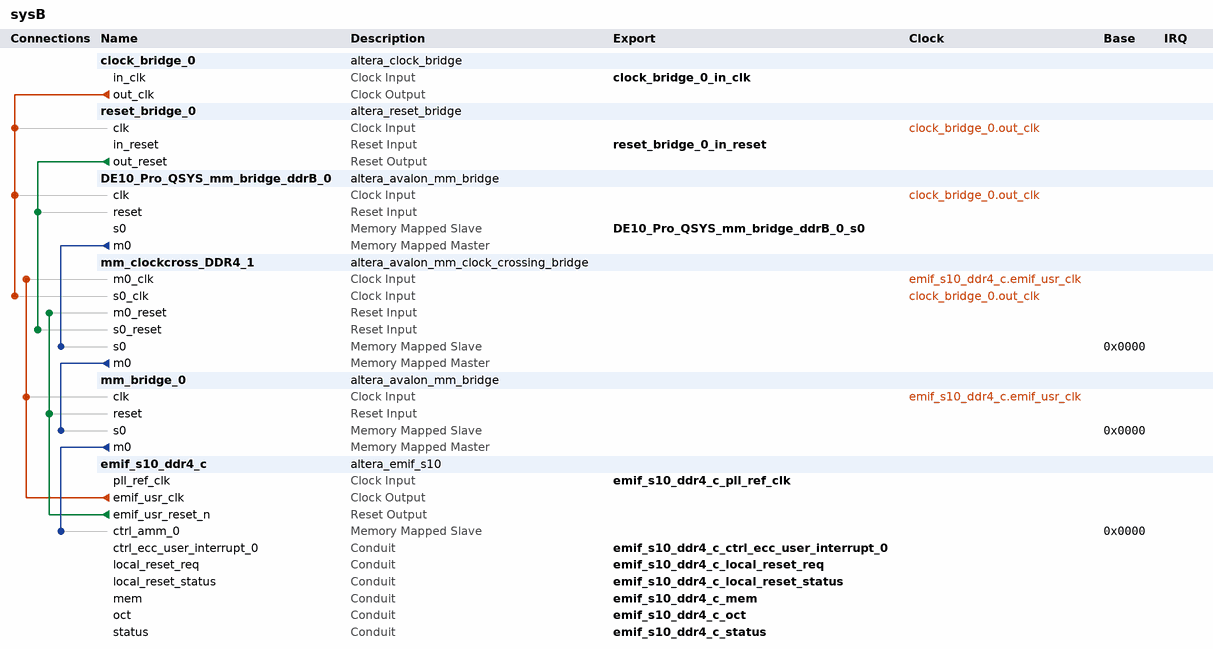
[diagram p0: system contents]
# Platform Designer (Qsys) system sysB, Stratix 10 1SX280HU2F50E1VG
# Parameters at their usual value, and those the tool derives, are not listed.
package require -exact qsys 1.0
create_system sysB
set_project_property DEVICE_FAMILY {Stratix 10}
set_project_property DEVICE 1SX280HU2F50E1VG

add_component clock_bridge_0 ip/sysB/sysB_clock_bridge_0.ip altera_clock_bridge clock_bridge_0 19.1
load_component clock_bridge_0
set_component_parameter_value DERIVED_CLOCK_RATE 100000000
set_component_parameter_value EXPLICIT_CLOCK_RATE 0
save_component

add_component reset_bridge_0 ip/sysB/sysB_reset_bridge_0.ip altera_reset_bridge reset_bridge_0 19.1
load_component reset_bridge_0
set_component_parameter_value ACTIVE_LOW_RESET 0
set_component_parameter_value SYNCHRONOUS_EDGES deassert
set_component_parameter_value SYNC_RESET 0
save_component

add_component DE10_Pro_QSYS_mm_bridge_ddrB_0 ip/DE10_Pro_QSYS/DE10_Pro_QSYS_mm_bridge_ddrB_0.ip altera_avalon_mm_bridge DE10_Pro_QSYS_mm_bridge_ddrB_0 19.1

add_component mm_clockcross_DDR4_1 ip/DE10_Pro_QSYS/mm_clockcross_DDR4_0.ip altera_avalon_mm_clock_crossing_bridge mm_clockcross_DDR4_1 19.1

add_component mm_bridge_0 ip/sysB/sysB_mm_bridge_0.ip altera_avalon_mm_bridge mm_bridge_0 19.1
load_component mm_bridge_0
set_component_parameter_value DATA_WIDTH 256
set_component_parameter_value ADDRESS_WIDTH 10
set_component_parameter_value USE_AUTO_ADDRESS_WIDTH 1
set_component_parameter_value ADDRESS_UNITS WORDS
set_component_parameter_value MAX_PENDING_RESPONSES 4
set_component_parameter_value SYNC_RESET 0
save_component

add_component emif_s10_ddr4_c ip/DE10_Pro_QSYS/DE10_Pro_QSYS_emif_s10_ddr4_c.ip altera_emif_s10 emif_s10_ddr4_c 19.1.0

# connections
add_connection clock_bridge_0.out_clk DE10_Pro_QSYS_mm_bridge_ddrB_0.clk clock
add_connection clock_bridge_0.out_clk mm_clockcross_DDR4_1.s0_clk clock
add_connection clock_bridge_0.out_clk reset_bridge_0.clk clock
add_connection emif_s10_ddr4_c.emif_usr_clk mm_bridge_0.clk clock
add_connection emif_s10_ddr4_c.emif_usr_clk mm_clockcross_DDR4_1.m0_clk clock
add_connection emif_s10_ddr4_c.emif_usr_reset_n mm_bridge_0.reset reset
add_connection emif_s10_ddr4_c.emif_usr_reset_n mm_clockcross_DDR4_1.m0_reset reset
add_connection reset_bridge_0.out_reset DE10_Pro_QSYS_mm_bridge_ddrB_0.reset reset
add_connection reset_bridge_0.out_reset mm_clockcross_DDR4_1.s0_reset reset
add_connection DE10_Pro_QSYS_mm_bridge_ddrB_0.m0 mm_clockcross_DDR4_1.s0 avalon
set_connection_parameter_value DE10_Pro_QSYS_mm_bridge_ddrB_0.m0/mm_clockcross_DDR4_1.s0 baseAddress 0x0000
add_connection mm_bridge_0.m0 emif_s10_ddr4_c.ctrl_amm_0 avalon
set_connection_parameter_value mm_bridge_0.m0/emif_s10_ddr4_c.ctrl_amm_0 baseAddress 0x0000
add_connection mm_clockcross_DDR4_1.m0 mm_bridge_0.s0 avalon
set_connection_parameter_value mm_clockcross_DDR4_1.m0/mm_bridge_0.s0 baseAddress 0x0000

# exported interfaces
add_interface DE10_Pro_QSYS_mm_bridge_ddrB_0_s0 avalon slave
set_interface_property DE10_Pro_QSYS_mm_bridge_ddrB_0_s0 EXPORT_OF DE10_Pro_QSYS_mm_bridge_ddrB_0.s0
add_interface clock_bridge_0_in_clk clock sink
set_interface_property clock_bridge_0_in_clk EXPORT_OF clock_bridge_0.in_clk
add_interface emif_s10_ddr4_c_ctrl_ecc_user_interrupt_0 conduit end
set_interface_property emif_s10_ddr4_c_ctrl_ecc_user_interrupt_0 EXPORT_OF emif_s10_ddr4_c.ctrl_ecc_user_interrupt_0
add_interface emif_s10_ddr4_c_local_reset_req conduit end
set_interface_property emif_s10_ddr4_c_local_reset_req EXPORT_OF emif_s10_ddr4_c.local_reset_req
add_interface emif_s10_ddr4_c_local_reset_status conduit end
set_interface_property emif_s10_ddr4_c_local_reset_status EXPORT_OF emif_s10_ddr4_c.local_reset_status
add_interface emif_s10_ddr4_c_mem conduit end
set_interface_property emif_s10_ddr4_c_mem EXPORT_OF emif_s10_ddr4_c.mem
add_interface emif_s10_ddr4_c_oct conduit end
set_interface_property emif_s10_ddr4_c_oct EXPORT_OF emif_s10_ddr4_c.oct
add_interface emif_s10_ddr4_c_pll_ref_clk clock sink
set_interface_property emif_s10_ddr4_c_pll_ref_clk EXPORT_OF emif_s10_ddr4_c.pll_ref_clk
add_interface emif_s10_ddr4_c_status conduit end
set_interface_property emif_s10_ddr4_c_status EXPORT_OF emif_s10_ddr4_c.status
add_interface reset_bridge_0_in_reset reset sink
set_interface_property reset_bridge_0_in_reset EXPORT_OF reset_bridge_0.in_reset

save_system sysB.qsys
